# EasyEDA schematic SCH_AUDIO5822.json
TITLE: AUDIO5822; REV: 1.0; Date: 2025-02-28; Sheet: 1/1; Drawn By: Juan Antonio Rodríguez Alcaraz; Company: Independent Developer
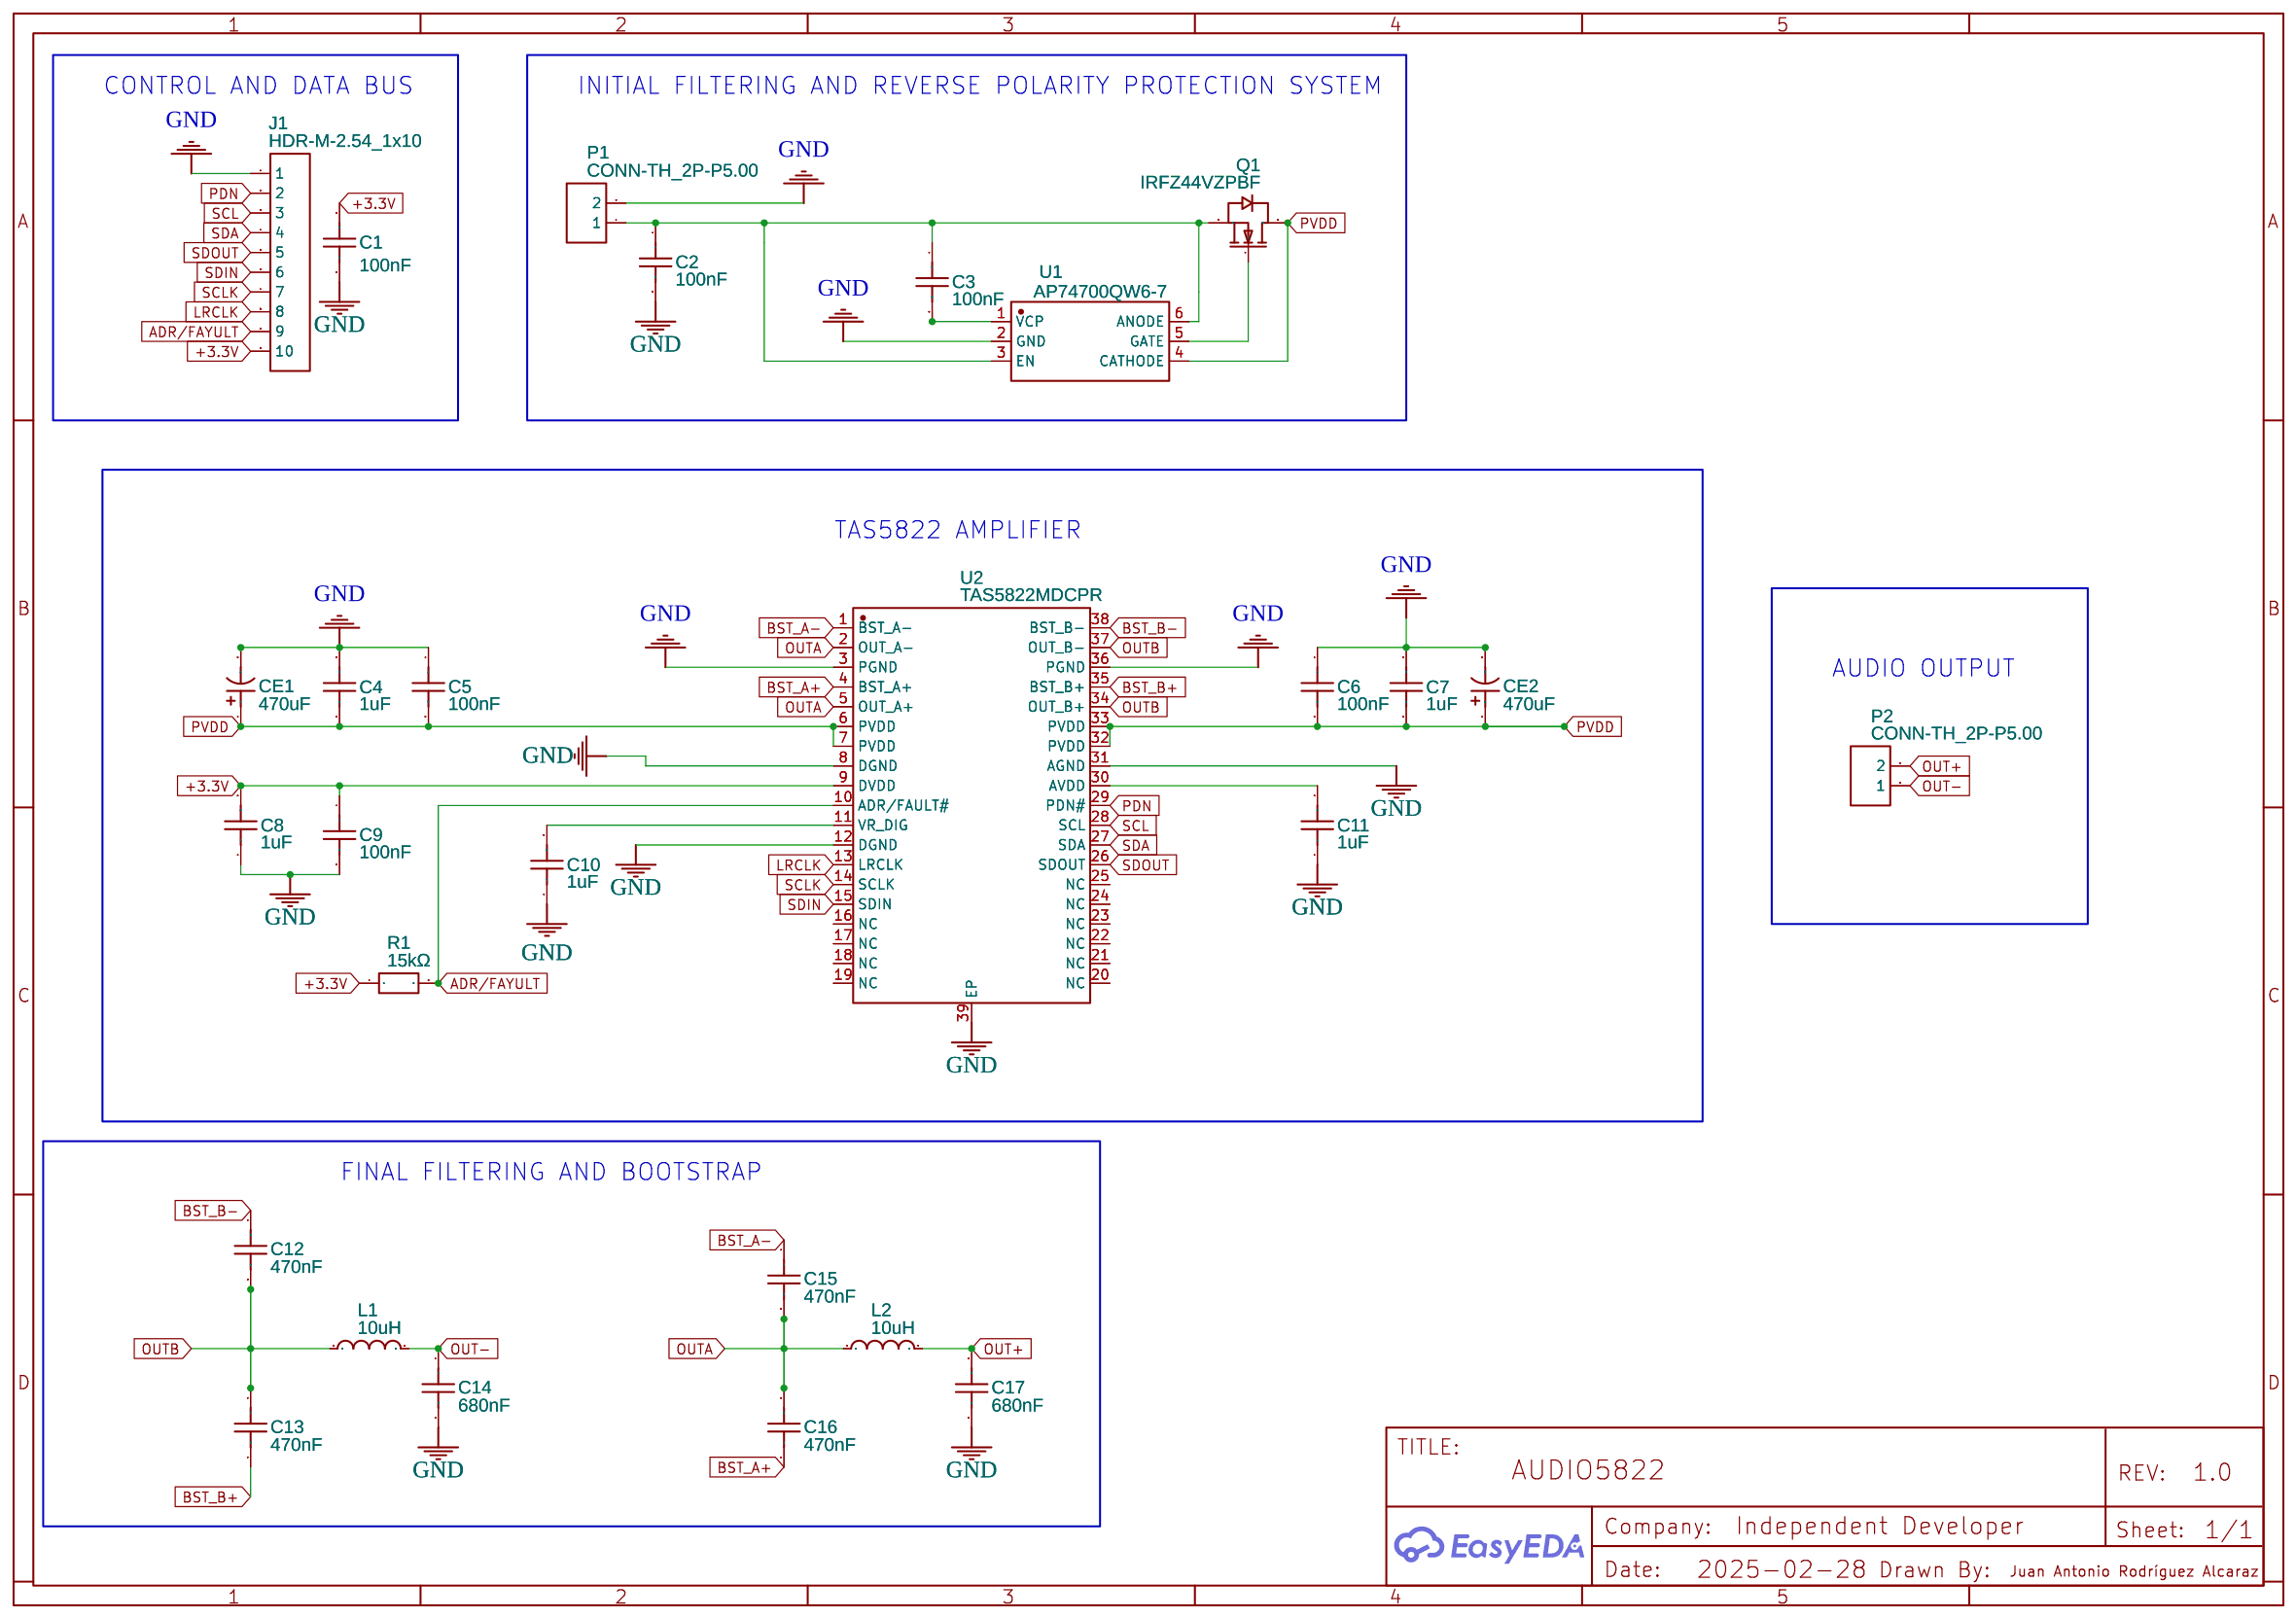
[diagram p0: schematic sheet]

## Parts
C1  100nF  [C0603]
C2  100nF  [C0603]
C3  100nF  [C0603]
C4  1uF  [C0603]
C5  100nF  [C0603]
C6  100nF  [C0603]
C7  1uF  [C0603]
C8  1uF  [C0603]
C9  100nF  [C0603]
C10  1uF  [C0603]
C11  1uF  [C0603]
C12  470nF  [C0603]
C13  470nF  [C0603]
C14  680nF  [C0603]
C15  470nF  [C0603]
C16  470nF  [C0603]
C17  680nF  [C0603]
CE1  470uF  [CAP-TH_BD10.0-P5.00-D0.6-FD]
CE2  470uF  [CAP-TH_BD10.0-P5.00-D0.6-FD]
J1  HDR-M-2.54_1x10  [HDR-M-2.54_1X10]
L1  10uH  [IND-SMD_L13.5-W12.8_APH1265T]
L2  10uH  [IND-SMD_L13.5-W12.8_APH1265T]
P1  CONN-TH_2P-P5.00  [CONN-TH_2P-P5.00]
P2  CONN-TH_2P-P5.00  [CONN-TH_2P-P5.00]
Q1  IRFZ44VZPBF  [TO-220-3_L10.0-W4.5-P2.54-L]
R1  15kΩ  [R0402]
U1  AP74700QW6-7  [SOT-26_L3.0-W1.6-P0.95-LS2.8-BR]
U2  TAS5822MDCPR  [HTSSOP-38_L9.8-W4.4-P0.50-LS6.4-BL-EP]

## Library data of the parts
C1-C3 C5 C6 C9 = 0603B104K101NT: Supplier: LCSC; Manufacturer: FH(风华); Supplier Part: C88219; JLCPCB Part Class: Extended Part
C4 C7 C8 C10 C11 = 0603X105K500: Contributor: LCSC; Supplier: LCSC; Supplier Part: C141872; Manufacturer: Walsin(华新科); Manufacturer Part: 0603X105K500CT; JLCPCB Part Class: Extended Part
C12 C13 C15 C16 = HGC0603R7474K500NTHJ: Supplier: LCSC; Supplier Part: C33546006; Manufacturer: Chinocera(华瓷); JLCPCB Part Class: Extended Part; Contributor: lcsc
C14 C17 = TCC0603X7R684K500CT: Supplier: LCSC; Supplier Part: C5360852; Manufacturer: CCTC(三环); JLCPCB Part Class: Extended Part; Contributor: lcsc
CE1 CE2 = KM1V471M1016: Contributor: lcsc; Supplier: LCSC; Supplier Part: C2873996; Manufacturer: ROQANG(容强)
J1 = HDR-M-2.54_1x10: Supplier Part: C57369; Supplier: LCSC; Contributor: LCEDA_Lib
L1 L2 = APH1265T100M: Supplier: LCSC; Supplier Part: C5349630; Manufacturer: APV(爱普微); JLCPCB Part Class: Extended Part; Contributor: lcsc
P1 P2 = CONN-TH_2P-P5.00: Supplier: LCSC; Contributor: LCEDA_Lib
Q1 = IRFZ44VZPBF: Contributor: LCSC; Supplier: LCSC; Supplier Part: C538077; Manufacturer: Infineon(英飞凌); JLCPCB Part Class: Extended Part
R1 = AF0402FR-0715KL: Contributor: LCSC; Supplier: LCSC; Supplier Part: C723443; Manufacturer: YAGEO(国巨); JLCPCB Part Class: Extended Part
U1 = AP74700QW6-7: Contributor: lcsc; Supplier: LCSC; Supplier Part: C5381661; Manufacturer: DIODES(美台); JLCPCB Part Class: Extended Part
U2 = TAS5822MDCPR: Contributor: LCSC; Supplier: LCSC; Supplier Part: C2866479; Manufacturer: TI(德州仪器)

## Nets
+3.3V: C1.1 C8.2 C9.1 J1.10 R1.1 U2.9(DVDD)
GND: C1.2 C2.2 C4.2 C5.1 C6.1 C7.2 C8.1 C9.2 C10.1 C11.1 C14.2 C17.2 CE1.2 CE2.2 J1.1 P1.2 U1.2(GND) U2.3(PGND) U2.8(DGND) U2.12(DGND) U2.31(AGND) U2.36(PGND) U2.39(EP)
PVDD: C4.1 C5.2 C6.2 C7.1 CE1.1 CE2.1 Q1.2(D) U1.4(CATHODE) U2.6(PVDD) U2.7(PVDD) U2.32(PVDD) U2.33(PVDD)
ADR/FAYULT: J1.9 R1.2 U2.10(ADR/FAULT#)
BST_A+: C16.2 U2.4(BST_A+)
BST_A-: C15.1 U2.1(BST_A-)
BST_B+: C13.2 U2.35(BST_B+)
BST_B-: C12.1 U2.38(BST_B-)
LRCLK: J1.8 U2.13(LRCLK)
OUT+: C17.1 L2.2 P2.2
OUT-: C14.1 L1.2 P2.1
OUTA: C15.2 C16.1 L2.1 U2.2(OUT_A-) U2.5(OUT_A+)
OUTB: C12.2 C13.1 L1.1 U2.34(OUT_B+) U2.37(OUT_B-)
PDN: J1.2 U2.29(PDN#)
SCL: J1.3 U2.28(SCL)
SCLK: J1.7 U2.14(SCLK)
SDA: J1.4 U2.27(SDA)
SDIN: J1.6 U2.15(SDIN)
SDOUT: J1.5 U2.26(SDOUT)
Net-(C2-1): C2.1 C3.1 P1.1 Q1.3(S) U1.3(EN) U1.6(ANODE)
Net-(C3-2): C3.2 U1.1(VCP)
Net-(C10-2): C10.2 U2.11(VR_DIG)
Net-(C11-2): C11.2 U2.30(AVDD)
Net-(Q1-1): Q1.1(G) U1.5(GATE)

Not connected (* = marked no-connect by the designer): U2 16(NC) 17(NC) 18(NC) 19(NC) 20(NC) 21(NC) 22(NC) 23(NC) 24(NC) 25(NC)

## Notes on the sheet
- CONTROL AND DATA BUS
- INITIAL FILTERING AND REVERSE POLARITY PROTECTION SYSTEM
- TAS5822 AMPLIFIER
- AUDIO OUTPUT
- FINAL FILTERING AND BOOTSTRAP
